# EAGLE design 7Segment Hex Display (EAGLE 7.5.0)
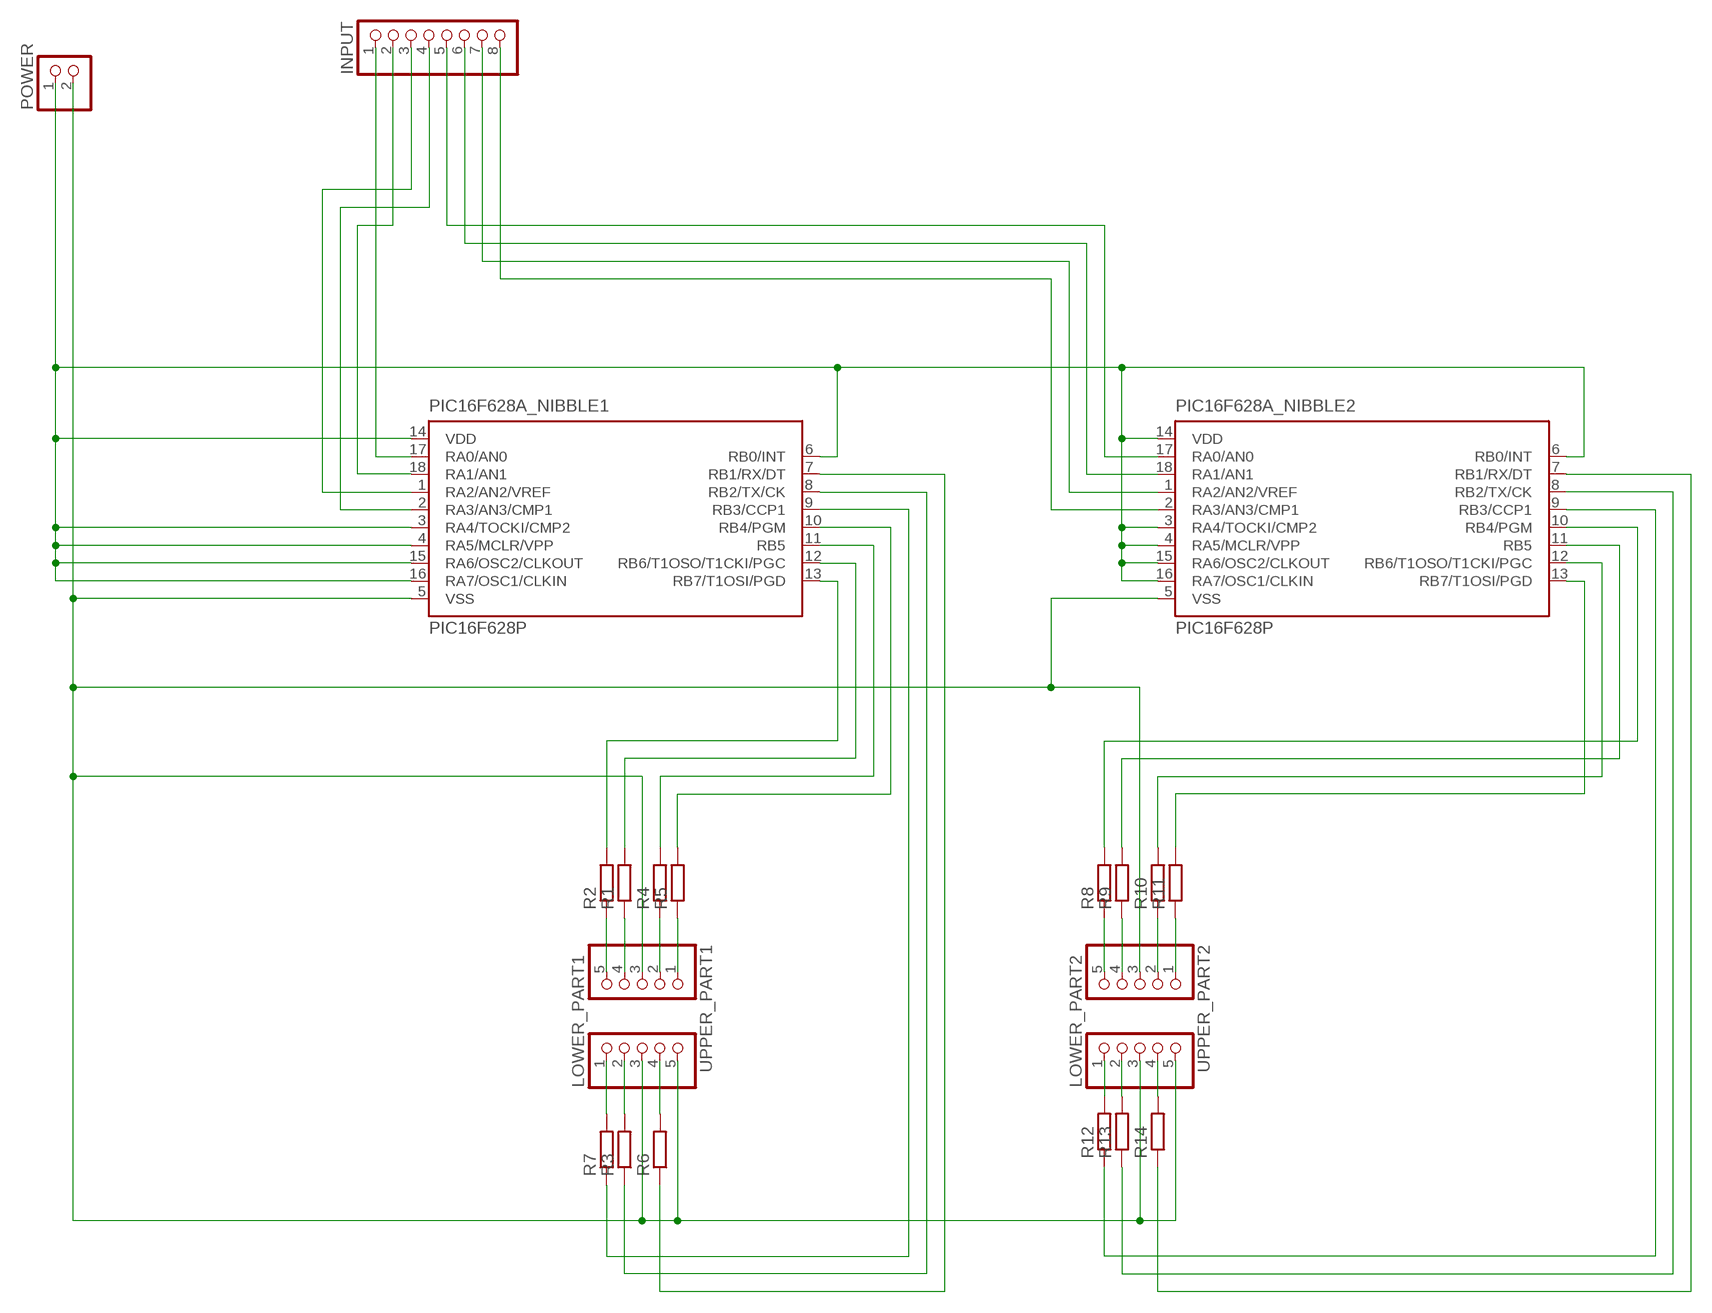
[diagram p0: schematic, sheet 1]

## Parts
INPUT  PINHD-1X8  [1X08]
LOWER_PART1  PINHD-1X5  [1X05]
LOWER_PART2  PINHD-1X5  [1X05]
PIC16F628A_NIBBLE1  PIC16F628P  [DIL18]
PIC16F628A_NIBBLE2  PIC16F628P  [DIL18]
POWER  PINHD-1X2  [1X02]
R1  R-EU_0207/10  [0207/10]
R2  R-EU_0207/10  [0207/10]
R3  R-EU_0207/10  [0207/10]
R4  R-EU_0207/10  [0207/10]
R5  R-EU_0207/10  [0207/10]
R6  R-EU_0207/10  [0207/10]
R7  R-EU_0207/10  [0207/10]
R8  R-EU_0207/10  [0207/10]
R9  R-EU_0207/10  [0207/10]
R10  R-EU_0207/10  [0207/10]
R11  R-EU_0207/10  [0207/10]
R12  R-EU_0207/10  [0207/10]
R13  R-EU_0207/10  [0207/10]
R14  R-EU_0207/10  [0207/10]
UPPER_PART1  PINHD-1X5  [1X05]
UPPER_PART2  PINHD-1X5  [1X05]

## Nets
N$1: INPUT.3 PIC16F628A_NIBBLE1.1(RA2/AN2/VREF)
N$2: INPUT.4 PIC16F628A_NIBBLE1.2(RA3/AN3/CMP1)
N$3: R2.1 UPPER_PART1.5
N$4: PIC16F628A_NIBBLE1.13(RB7/T1OSI/PGD) R2.2
N$5: INPUT.2 PIC16F628A_NIBBLE1.18(RA1/AN1)
N$6: INPUT.1 PIC16F628A_NIBBLE1.17(RA0/AN0)
N$7: PIC16F628A_NIBBLE1.3(RA4/TOCKI/CMP2) PIC16F628A_NIBBLE1.4(RA5/MCLR/VPP) PIC16F628A_NIBBLE1.6(RB0/INT) PIC16F628A_NIBBLE1.14(VDD) PIC16F628A_NIBBLE1.15(RA6/OSC2/CLKOUT) PIC16F628A_NIBBLE1.16(RA7/OSC1/CLKIN) PIC16F628A_NIBBLE2.3(RA4/TOCKI/CMP2) PIC16F628A_NIBBLE2.4(RA5/MCLR/VPP) PIC16F628A_NIBBLE2.6(RB0/INT) PIC16F628A_NIBBLE2.14(VDD) PIC16F628A_NIBBLE2.15(RA6/OSC2/CLKOUT) PIC16F628A_NIBBLE2.16(RA7/OSC1/CLKIN) POWER.1
N$8: LOWER_PART1.3 LOWER_PART1.5 LOWER_PART2.3 LOWER_PART2.5 PIC16F628A_NIBBLE1.5(VSS) PIC16F628A_NIBBLE2.5(VSS) POWER.2 UPPER_PART1.3 UPPER_PART2.3
N$9: PIC16F628A_NIBBLE1.12(RB6/T1OSO/T1CKI/PGC) R1.2
N$10: R1.1 UPPER_PART1.4
N$11: PIC16F628A_NIBBLE1.8(RB2/TX/CK) R3.1
N$12: PIC16F628A_NIBBLE1.11(RB5) R4.2
N$13: PIC16F628A_NIBBLE1.10(RB4/PGM) R5.2
N$14: LOWER_PART1.2 R3.2
N$15: R4.1 UPPER_PART1.2
N$16: R5.1 UPPER_PART1.1
N$17: PIC16F628A_NIBBLE1.9(RB3/CCP1) R7.1
N$18: LOWER_PART1.1 R7.2
N$19: PIC16F628A_NIBBLE2.7(RB1/RX/DT) R14.1
N$20: PIC16F628A_NIBBLE1.7(RB1/RX/DT) R6.1
N$21: LOWER_PART1.4 R6.2
N$24: R8.1 UPPER_PART2.5
N$25: INPUT.5 PIC16F628A_NIBBLE2.17(RA0/AN0)
N$26: INPUT.6 PIC16F628A_NIBBLE2.18(RA1/AN1)
N$27: INPUT.7 PIC16F628A_NIBBLE2.1(RA2/AN2/VREF)
N$28: INPUT.8 PIC16F628A_NIBBLE2.2(RA3/AN3/CMP1)
N$29: R9.1 UPPER_PART2.4
N$30: R10.1 UPPER_PART2.2
N$31: R11.1 UPPER_PART2.1
N$32: LOWER_PART2.1 R12.2
N$33: LOWER_PART2.2 R13.2
N$34: LOWER_PART2.4 R14.2
N$35: PIC16F628A_NIBBLE2.13(RB7/T1OSI/PGD) R11.2
N$36: PIC16F628A_NIBBLE2.12(RB6/T1OSO/T1CKI/PGC) R10.2
N$37: PIC16F628A_NIBBLE2.11(RB5) R9.2
N$38: PIC16F628A_NIBBLE2.10(RB4/PGM) R8.2
N$39: PIC16F628A_NIBBLE2.9(RB3/CCP1) R12.1
N$40: PIC16F628A_NIBBLE2.8(RB2/TX/CK) R13.1

## Library data of the parts
INPUT = pinhead:PINHD-1X8: PIN HEADER
LOWER_PART1 LOWER_PART2 UPPER_PART1 UPPER_PART2 = pinhead:PINHD-1X5: PIN HEADER
PIC16F628A_NIBBLE1 PIC16F628A_NIBBLE2 = microchip:PIC16F62*: FLASH-Based 8-Bit CMOS Microcontroller Source: http://ww1.microchip.com/downloads/en/DeviceDoc/40300C.pdf; MF: MICROCHIP; MPN: PIC16F628-04I/P; OC_FARNELL: 9760407; OC_NEWARK: 19C7272
POWER = pinhead:PINHD-1X2: PIN HEADER
R1-R14 = resistor:R-EU_: RESISTOR, European symbol

## Board
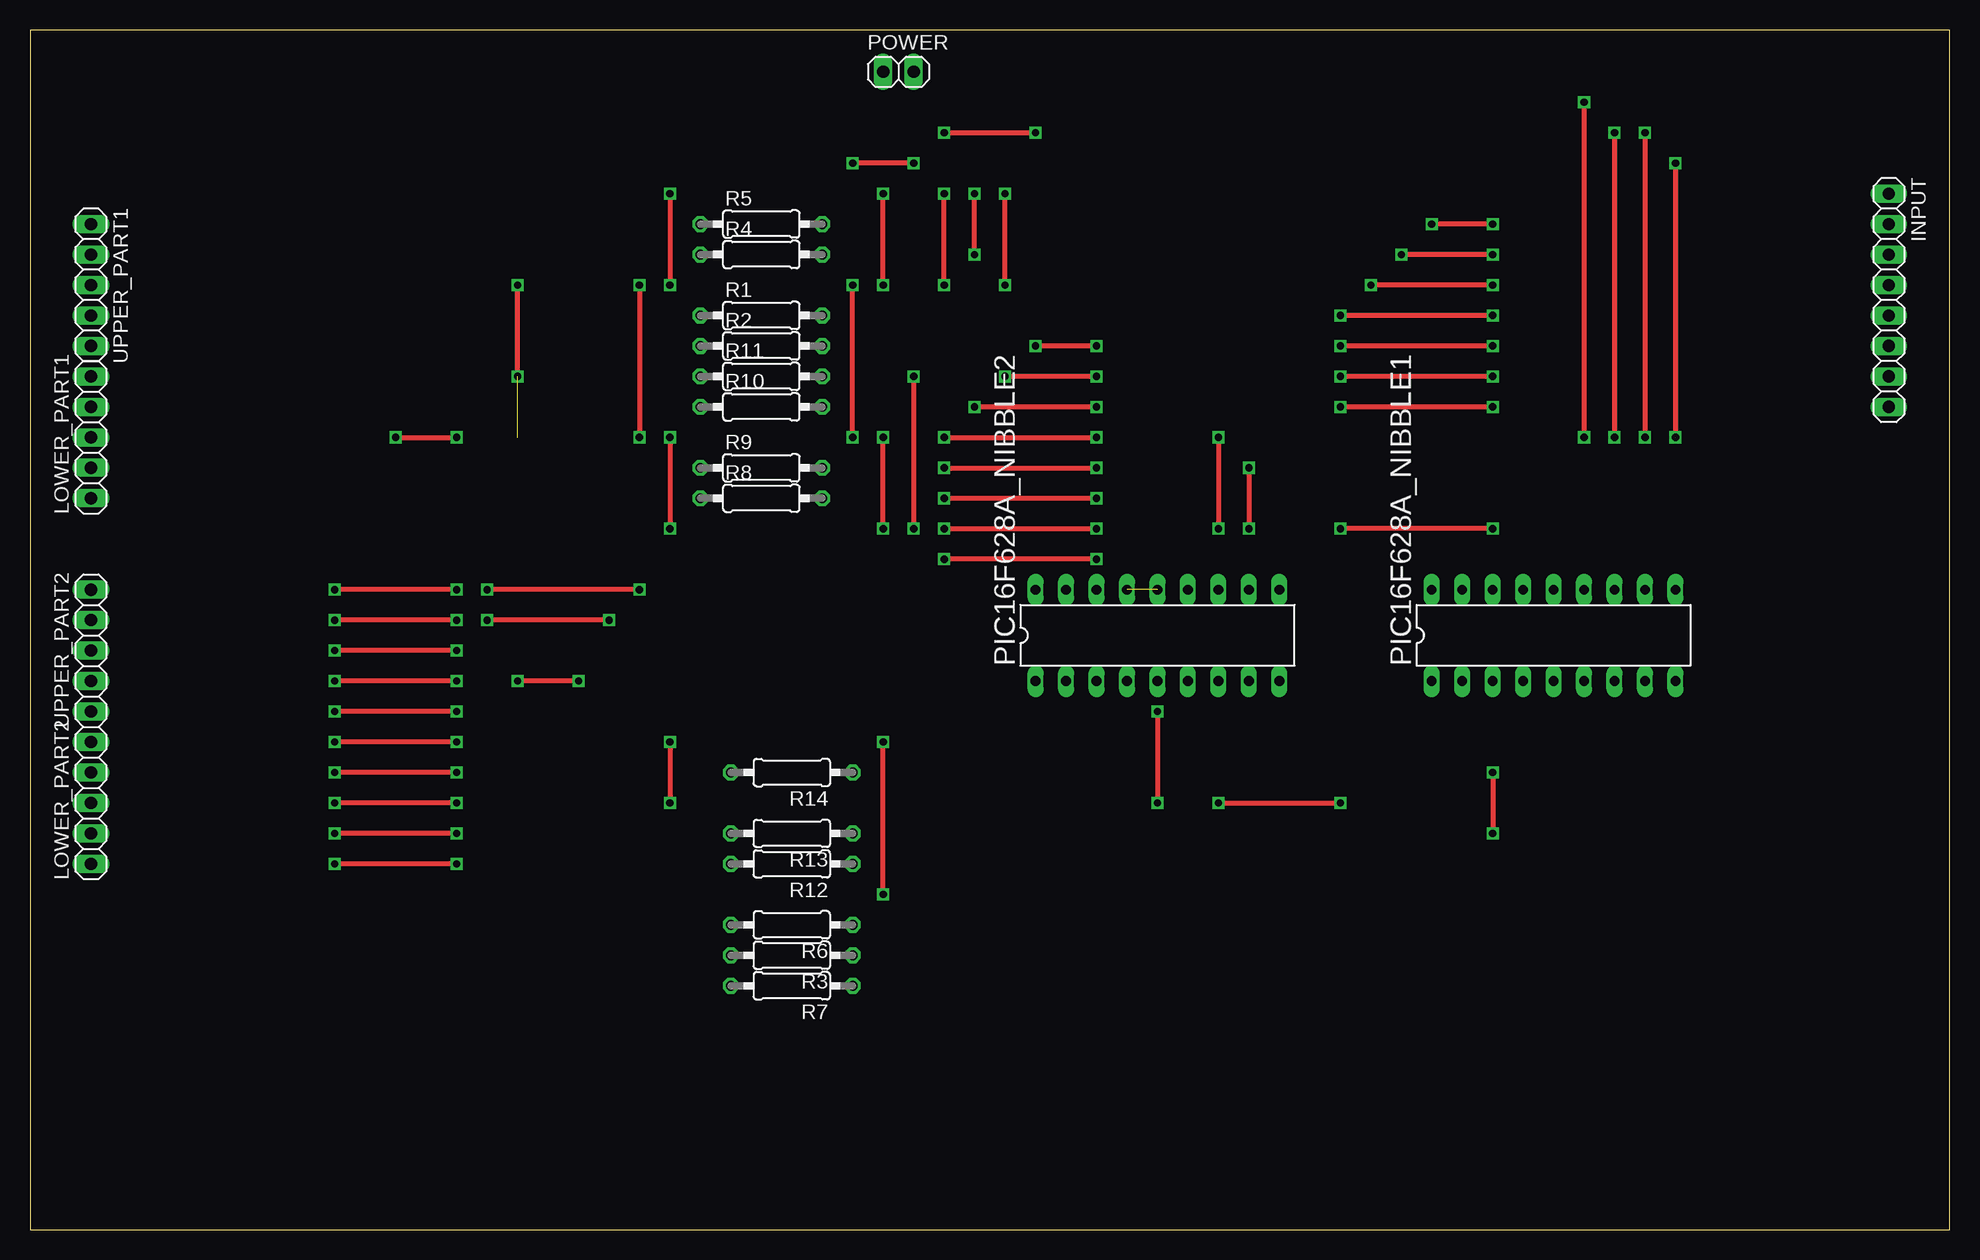
[diagram p1: board, top side]
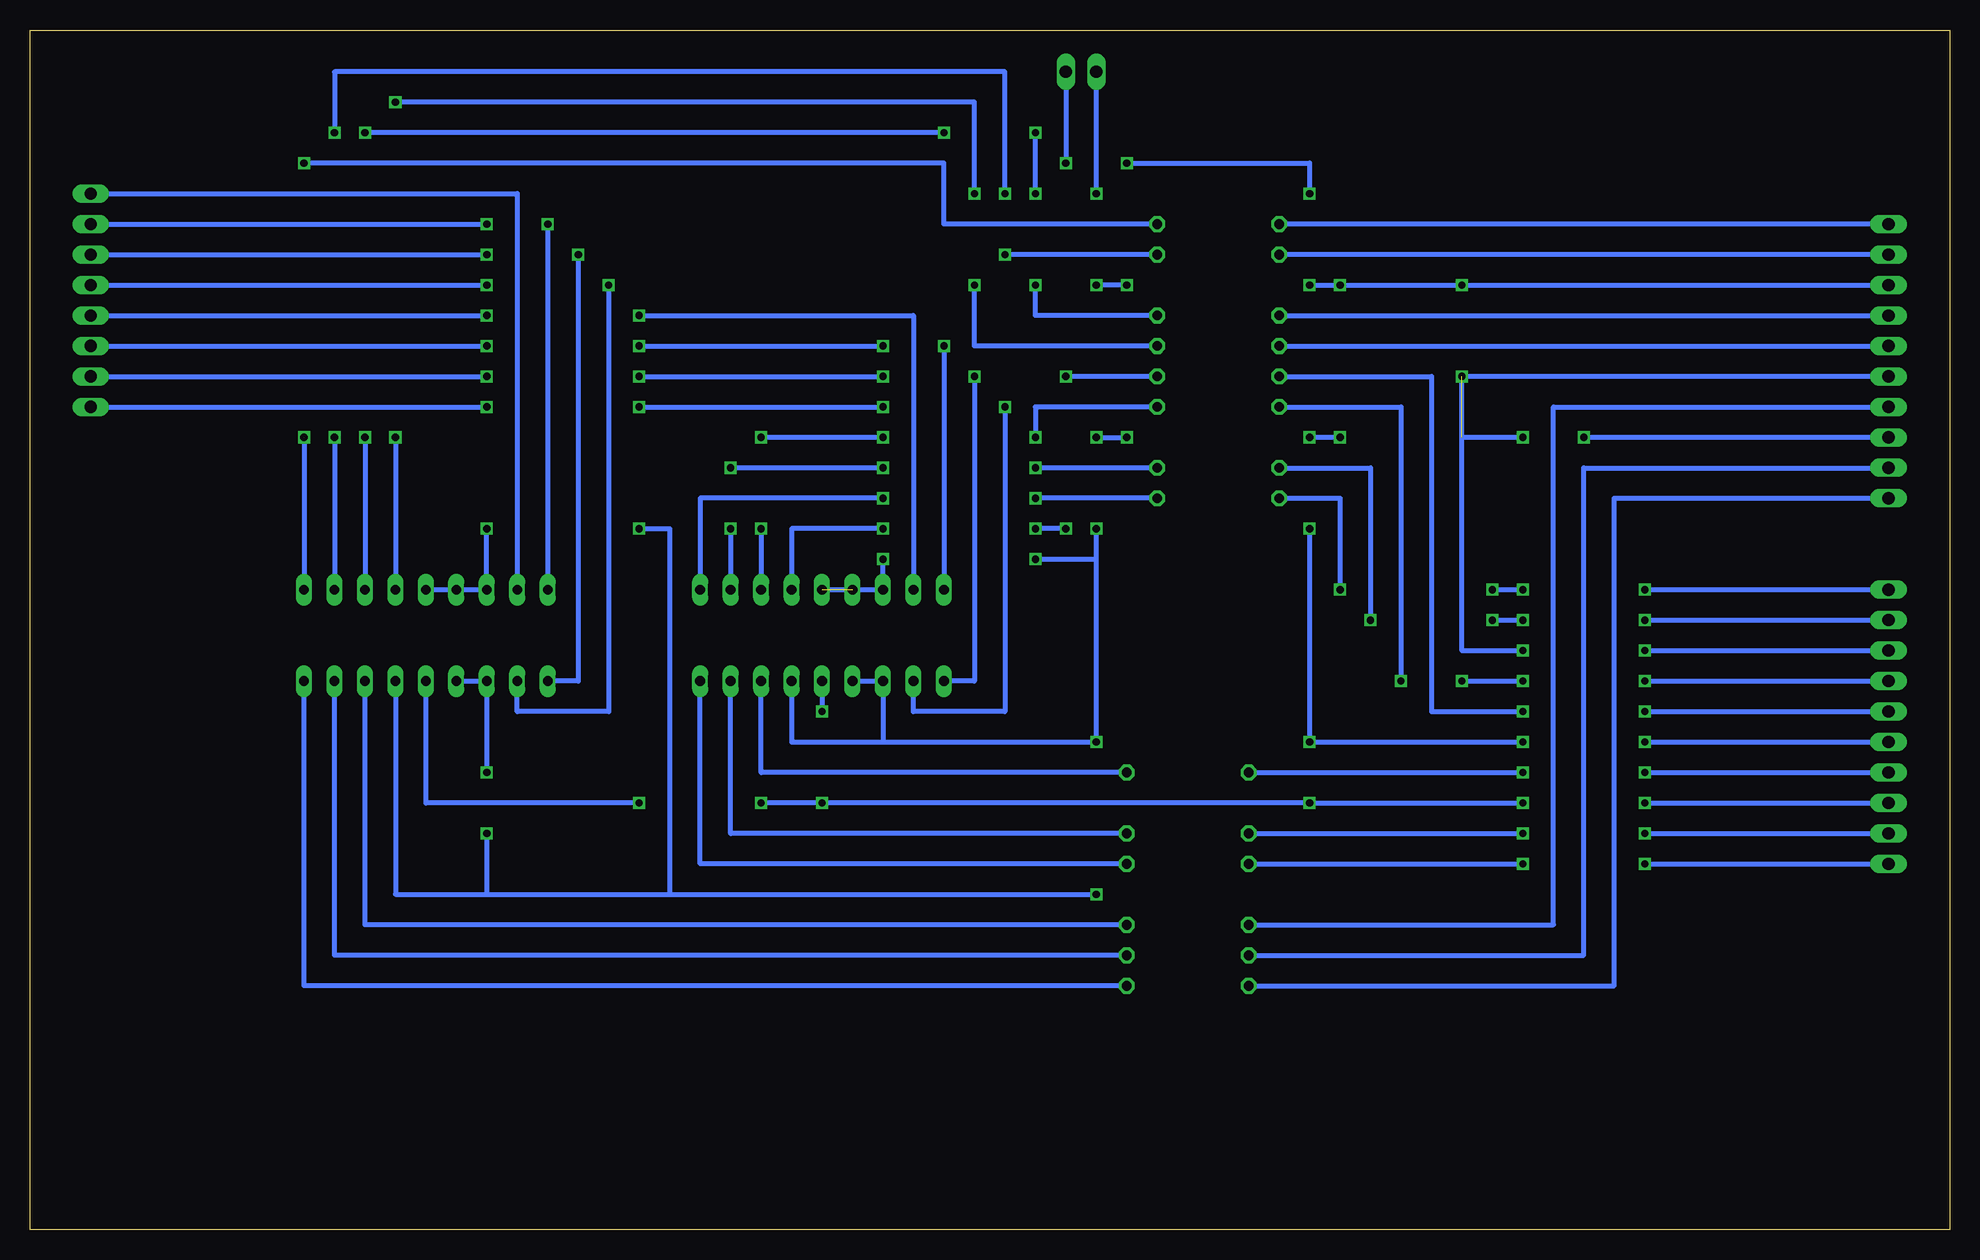
[diagram p2: board, bottom side, seen from below]

Size 160 x 100 mm. Coordinates in mm from the lower left corner, seen from the top.
Outline: 0,0 160,0 160,100 0,100 0,0
Copper layers (1*16): Top 0.035mm / dielectric 1.5mm / Bottom 0.035mm
Design rules "default": minimum track width 10mil, minimum drill 24mil, track to track 8mil, track to pad 8mil, pad to pad 8mil, via to via 8mil, smd to smd 8mil, copper to edge 40mil, drill to drill 8mil, minimum pad ring 10mil, minimum via ring 8mil, stop-mask expansion 4mil, vias tented up to drill 0mil, thermal gap 10mil

### Footprints (pad centres in the part's own frame; a part is rotated, then mirrored left to right if it is on the bottom)
1X08 = drill 1.016 long: 1 -8.89,0; 2 -6.35,0; 3 -3.81,0; 4 -1.27,0; 5 1.27,0; 6 3.81,0; 7 6.35,0; 8 8.89,0
1X05 = drill 1.016 long: 1 -5.08,0; 2 -2.54,0; 3 0,0; 4 2.54,0; 5 5.08,0
DIL18 = drill 0.813 long: 1 -10.16,-3.81; 2 -7.62,-3.81; 3 -5.08,-3.81; 4 -2.54,-3.81; 5 0,-3.81; 6 2.54,-3.81; 7 5.08,-3.81; 8 7.62,-3.81; 9 10.16,-3.81; 10 10.16,3.81; 11 7.62,3.81; 12 5.08,3.81; 13 2.54,3.81; 14 0,3.81; 15 -2.54,3.81; 16 -5.08,3.81; 17 -7.62,3.81; 18 -10.16,3.81
1X02 = drill 1.016 long: 1 -1.27,0; 2 1.27,0
0207/10 = drill 0.813 octagon: 1 -5.08,0; 2 5.08,0

### Placement (x,y rotation side)
INPUT  154.94,77.47 270 top
LOWER_PART1  5.08,66.04 90 top
LOWER_PART2  5.08,35.56 90 top
PIC16F628A_NIBBLE1  127,49.53 0 top
PIC16F628A_NIBBLE2  93.98,49.53 0 top
POWER  72.39,96.52 0 top
R1  60.96,76.2 0 top
R2  60.96,73.66 0 top
R3  63.5,22.86 180 top
R4  60.96,81.28 0 top
R5  60.96,83.82 0 top
R6  63.5,25.4 180 top
R7  63.5,20.32 180 top
R8  60.96,60.96 0 top
R9  60.96,63.5 0 top
R10  60.96,68.58 0 top
R11  60.96,71.12 0 top
R12  63.5,30.48 180 top
R13  63.5,33.02 180 top
R14  63.5,38.1 180 top
UPPER_PART1  5.08,78.74 270 top
UPPER_PART2  5.08,48.26 90 top

### Tracks (layer width: path | path; a pad name or v marks a point on that pad's centre or on a via)
N$1  (via drill 0.6)
  Top 0.406: v121.92,81.28 v114.3,81.28
  Bottom 0.406: INPUT.3 v121.92,81.28 | v114.3,81.28 114.3,45.72 PIC16F628A_NIBBLE1.1
N$2  (via drill 0.6)
  Top 0.406: v121.92,78.74 v111.76,78.74
  Bottom 0.406: INPUT.4 v121.92,78.74 | v111.76,78.74 111.76,43.18 119.38,43.18 PIC16F628A_NIBBLE1.2
N$3
  Bottom 0.406: R2.1 UPPER_PART1.5
N$4  (via drill 0.6)
  Top 0.406: v81.28,78.74 v81.28,86.36 | v129.54,93.98 v129.54,66.04
  Bottom 0.406: R2.2 81.28,73.66 v81.28,78.74 | v81.28,86.36 81.28,93.98 v129.54,93.98 | v129.54,66.04 PIC16F628A_NIBBLE1.13
N$5  (via drill 0.6)
  Top 0.406: v121.92,83.82 v116.84,83.82
  Bottom 0.406: INPUT.2 v121.92,83.82 | v116.84,83.82 PIC16F628A_NIBBLE1.18
N$6
  Bottom 0.406: INPUT.1 119.38,86.36 PIC16F628A_NIBBLE1.17
N$7  (via drill 0.6)  (1 unrouted)
  Top 0.406: v88.9,55.88 v76.2,55.88 | v71.12,58.42 v71.12,66.04 | v68.58,66.04 v68.58,78.74 | v71.12,78.74 v71.12,86.36 | v121.92,38.1 v121.92,33.02 | v71.12,27.94 v71.12,40.64 | v121.92,58.42 v109.22,58.42
  Bottom 0.406: PIC16F628A_NIBBLE2.14 PIC16F628A_NIBBLE2.16 v88.9,55.88 | v76.2,55.88 71.12,55.88 | 71.12,55.88 v71.12,58.42 | v71.12,66.04 v68.58,66.04 | v68.58,78.74 v71.12,78.74 | v71.12,86.36 POWER.1 | 88.9,40.64 PIC16F628A_NIBBLE2.3 PIC16F628A_NIBBLE2.4 | 88.9,40.64 v71.12,40.64 71.12,55.88 | PIC16F628A_NIBBLE2.6 96.52,40.64 88.9,40.64 | v121.92,38.1 PIC16F628A_NIBBLE1.3 PIC16F628A_NIBBLE1.4 | v121.92,33.02 121.92,27.94 | 121.92,27.94 106.68,27.94 | 106.68,27.94 v71.12,27.94 | PIC16F628A_NIBBLE1.6 129.54,27.94 121.92,27.94 | PIC16F628A_NIBBLE1.14 PIC16F628A_NIBBLE1.15 PIC16F628A_NIBBLE1.16 v121.92,58.42 | v109.22,58.42 106.68,58.42 106.68,27.94
N$8  (via drill 0.6)  (1 unrouted)
  Top 0.406: v93.98,43.18 v93.98,35.56 | v99.06,35.56 v109.22,35.56 | v73.66,88.9 v68.58,88.9 | v53.34,86.36 v53.34,78.74 | v50.8,78.74 v50.8,66.04 | v53.34,66.04 v53.34,58.42 | v53.34,40.64 v53.34,35.56 | v40.64,71.12 v40.64,78.74 | v35.56,48.26 v25.4,48.26 | v35.56,40.64 v25.4,40.64 | v35.56,35.56 v25.4,35.56 | v30.48,66.04 v35.56,66.04
  Bottom 0.406: PIC16F628A_NIBBLE2.5 v93.98,43.18 | v99.06,35.56 v93.98,35.56 v53.34,35.56 v35.56,35.56 | v109.22,35.56 127,35.56 PIC16F628A_NIBBLE1.5 | POWER.2 v73.66,88.9 | v68.58,88.9 53.34,88.9 v53.34,86.36 | v53.34,78.74 v50.8,78.74 v40.64,78.74 UPPER_PART1.3 | v50.8,66.04 v53.34,66.04 | v53.34,58.42 v53.34,40.64 v35.56,40.64 | LOWER_PART1.5 v40.64,71.12 40.64,66.04 | 40.64,66.04 40.64,48.26 v35.56,48.26 | v25.4,48.26 UPPER_PART2.3 | v25.4,40.64 LOWER_PART2.5 | v25.4,35.56 LOWER_PART2.3 | LOWER_PART1.3 v30.48,66.04 | v35.56,66.04 40.64,66.04
N$9  (via drill 0.6)
  Top 0.406: v76.2,78.74 v76.2,86.36 | v76.2,91.44 v83.82,91.44 | v132.08,91.44 v132.08,66.04
  Bottom 0.406: R1.2 76.2,76.2 v76.2,78.74 | v76.2,86.36 v76.2,91.44 | v83.82,91.44 v132.08,91.44 | v132.08,66.04 PIC16F628A_NIBBLE1.12
N$10
  Bottom 0.406: R1.1 UPPER_PART1.4
N$11
  Bottom 0.406: R3.1 134.62,22.86 PIC16F628A_NIBBLE1.8
N$12  (via drill 0.6)
  Top 0.406: v78.74,81.28 v78.74,86.36 | v134.62,91.44 v134.62,66.04
  Bottom 0.406: R4.2 v78.74,81.28 | v78.74,86.36 78.74,96.52 134.62,96.52 v134.62,91.44 | v134.62,66.04 PIC16F628A_NIBBLE1.11
N$13  (via drill 0.6)  (1 unrouted)
  Top 0.406: v137.16,88.9 v137.16,66.04
  Bottom 0.406: R5.2 83.82,83.82 83.82,88.9 v137.16,88.9 | v137.16,66.04 PIC16F628A_NIBBLE1.10
N$14
  Bottom 0.406: R3.2 30.48,22.86 30.48,63.5 LOWER_PART1.2
N$15
  Bottom 0.406: UPPER_PART1.2 R4.1
N$16
  Bottom 0.406: UPPER_PART1.1 R5.1
N$17
  Bottom 0.406: R7.1 137.16,20.32 PIC16F628A_NIBBLE1.9
N$18
  Bottom 0.406: R7.2 27.94,20.32 27.94,60.96 LOWER_PART1.1
N$19
  Bottom 0.406: R14.1 99.06,38.1 PIC16F628A_NIBBLE2.7
N$20
  Bottom 0.406: R6.1 132.08,25.4 PIC16F628A_NIBBLE1.7
N$21
  Bottom 0.406: R6.2 33.02,25.4 33.02,68.58 LOWER_PART1.4
N$24  (via drill 0.6)
  Top 0.406: v50.8,53.34 v38.1,53.34 | v35.56,53.34 v25.4,53.34
  Bottom 0.406: R8.1 50.8,60.96 v50.8,53.34 | v38.1,53.34 v35.56,53.34 | v25.4,53.34 UPPER_PART2.5
N$25  (via drill 0.6)
  Top 0.406: v121.92,76.2 v109.22,76.2
  Bottom 0.406: INPUT.5 v121.92,76.2 | v109.22,76.2 86.36,76.2 PIC16F628A_NIBBLE2.17
N$26  (via drill 0.6)
  Top 0.406: v121.92,73.66 v109.22,73.66 | v88.9,73.66 v83.82,73.66
  Bottom 0.406: INPUT.6 v121.92,73.66 | v109.22,73.66 v88.9,73.66 | v83.82,73.66 PIC16F628A_NIBBLE2.18
N$27  (via drill 0.6)
  Top 0.406: v121.92,71.12 v109.22,71.12 | v88.9,71.12 v81.28,71.12
  Bottom 0.406: INPUT.7 v121.92,71.12 | v109.22,71.12 v88.9,71.12 | v81.28,71.12 81.28,45.72 PIC16F628A_NIBBLE2.1
N$28  (via drill 0.6)
  Top 0.406: v121.92,68.58 v109.22,68.58 | v88.9,68.58 v78.74,68.58
  Bottom 0.406: INPUT.8 v121.92,68.58 | v109.22,68.58 v88.9,68.58 | v78.74,68.58 78.74,43.18 86.36,43.18 PIC16F628A_NIBBLE2.2
N$29  (via drill 0.6)
  Top 0.406: v48.26,50.8 v38.1,50.8 | v35.56,50.8 v25.4,50.8
  Bottom 0.406: R9.1 48.26,63.5 v48.26,50.8 | v38.1,50.8 v35.56,50.8 | v25.4,50.8 UPPER_PART2.4
N$30  (via drill 0.6)
  Top 0.406: v45.72,45.72 v40.64,45.72 | v35.56,45.72 v25.4,45.72
  Bottom 0.406: R10.1 45.72,68.58 v45.72,45.72 | v40.64,45.72 v35.56,45.72 | v25.4,45.72 UPPER_PART2.2
N$31  (via drill 0.6)
  Top 0.406: v35.56,43.18 v25.4,43.18
  Bottom 0.406: R11.1 43.18,71.12 43.18,43.18 v35.56,43.18 | v25.4,43.18 UPPER_PART2.1
N$32  (via drill 0.6)
  Top 0.406: v35.56,30.48 v25.4,30.48
  Bottom 0.406: R12.2 v35.56,30.48 | v25.4,30.48 LOWER_PART2.1
N$33  (via drill 0.6)
  Top 0.406: v35.56,33.02 v25.4,33.02
  Bottom 0.406: R13.2 v35.56,33.02 | v25.4,33.02 LOWER_PART2.2
N$34  (via drill 0.6)
  Top 0.406: v35.56,38.1 v25.4,38.1
  Bottom 0.406: R14.2 v35.56,38.1 | v25.4,38.1 LOWER_PART2.4
N$35  (via drill 0.6)
  Top 0.406: v73.66,71.12 v73.66,58.42 | v76.2,58.42 v88.9,58.42
  Bottom 0.406: R11.2 v73.66,71.12 | v73.66,58.42 v76.2,58.42 | v88.9,58.42 96.52,58.42 PIC16F628A_NIBBLE2.13
N$36  (via drill 0.6)
  Top 0.406: v76.2,66.04 v88.9,66.04 | v99.06,66.04 v99.06,58.42
  Bottom 0.406: R10.2 76.2,68.58 v76.2,66.04 | v88.9,66.04 v99.06,66.04 | v99.06,58.42 PIC16F628A_NIBBLE2.12
N$37  (via drill 0.6)
  Top 0.406: v76.2,63.5 v88.9,63.5 | v101.6,63.5 v101.6,58.42
  Bottom 0.406: R9.2 v76.2,63.5 | v88.9,63.5 v101.6,63.5 | v101.6,58.42 PIC16F628A_NIBBLE2.11
N$38  (via drill 0.6)
  Top 0.406: v76.2,60.96 v88.9,60.96
  Bottom 0.406: R8.2 v76.2,60.96 | v88.9,60.96 104.14,60.96 PIC16F628A_NIBBLE2.10
N$39
  Bottom 0.406: R12.1 104.14,30.48 PIC16F628A_NIBBLE2.9
N$40
  Bottom 0.406: R13.1 101.6,33.02 PIC16F628A_NIBBLE2.8